# EAGLE design Payloadv04 (EAGLE 9.2.0)
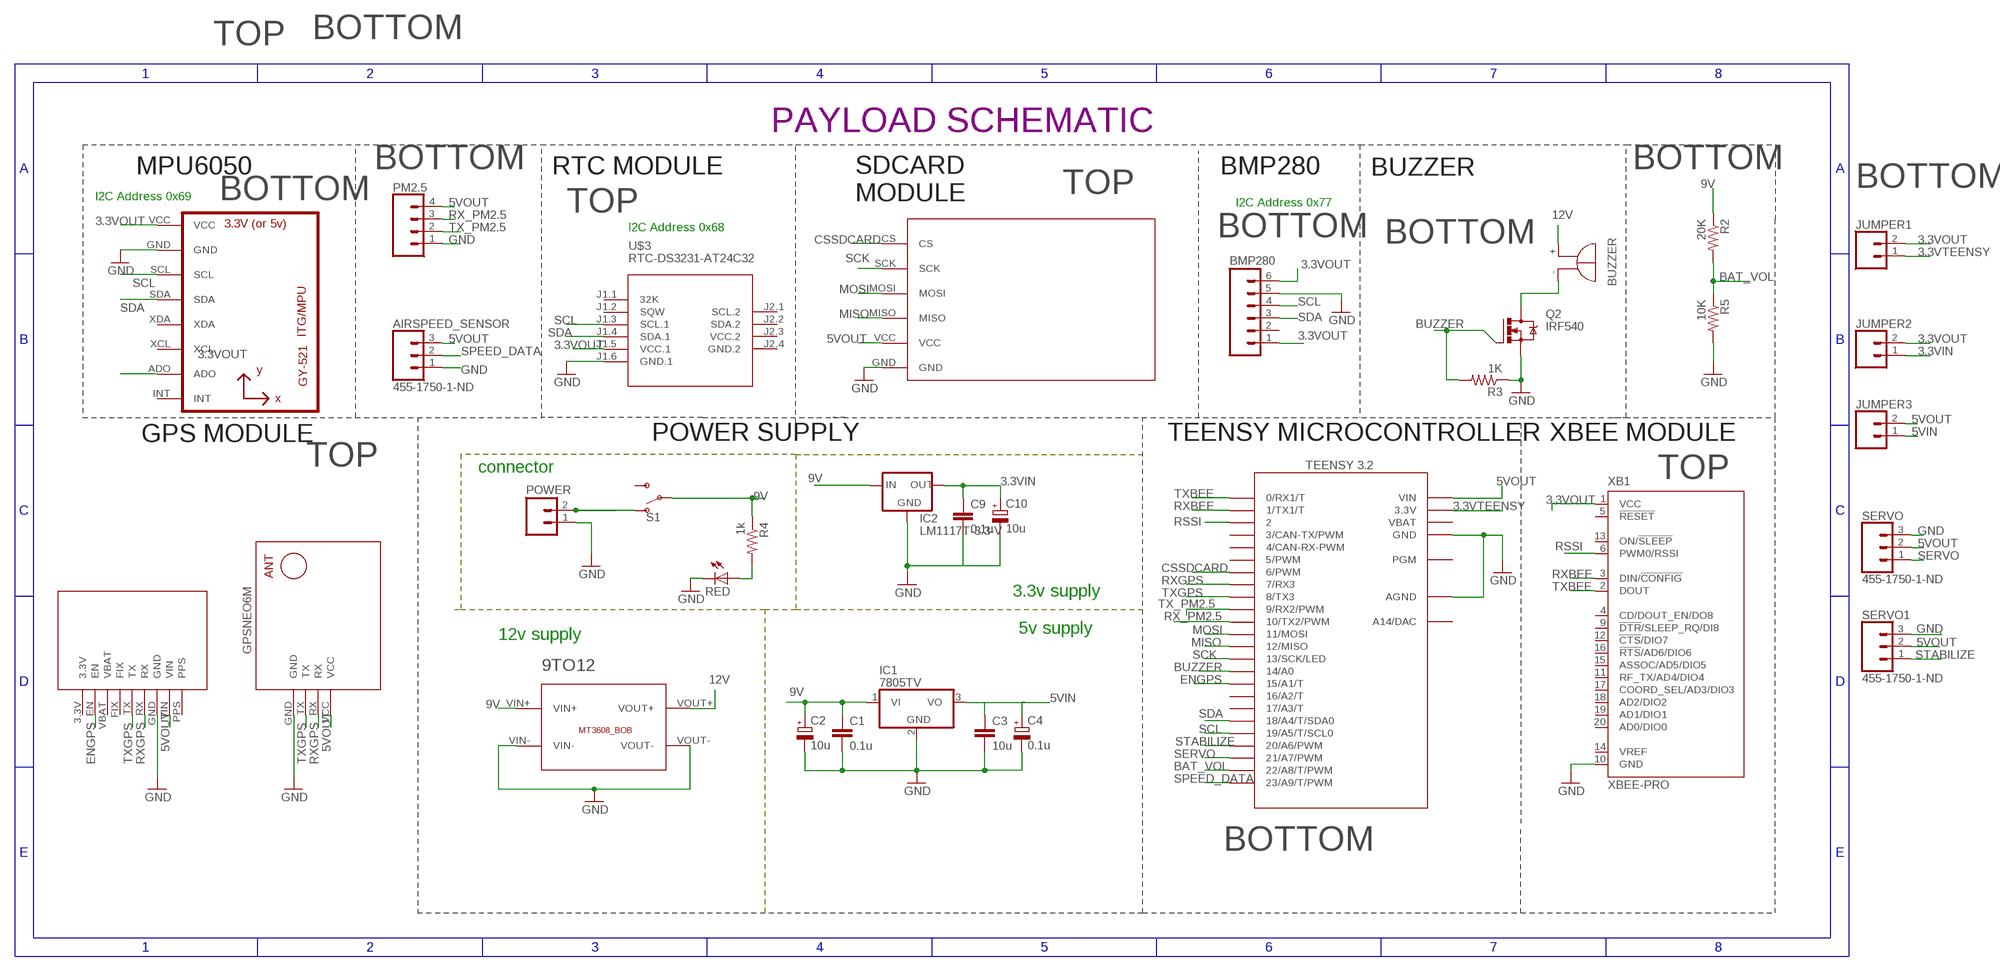
[diagram p0: schematic, sheet 1]

## Parts
9TO12  BREAKOUTS_MT3608_BOB  [BREAKOUTS_MT3608_BOB]
AIRSPEED_SENSOR  455-1750-1-ND  CONN_03  [1X03]
BMP280  M06  [06P]
C1  0.1u  C-EU025-025X050  [C025-025X050]
C2  10u  CPOL-EUE2.5-6  [E2,5-6]
C3  10u  C-EU025-025X050  [C025-025X050]
C4  0.1u  CPOL-EUE2.5-6  [E2,5-6]
C9  0.1u  C-EU025-025X050  [C025-025X050]
C10  10u  CPOL-EUE2.5-6  [E2,5-6]
IC1  7805TV  [TO220V]
IC2  LM1117T-3.3-V  [TO220V]
JUMPER1  CONN_02  [1X02]
JUMPER2  CONN_02  [1X02]
JUMPER3  CONN_02  [1X02]
PM2.5  CONN_04  [1X04]
POWER  CEDT_JANUARY_2015_V5_M02  [CEDT_JANUARY_2015_V5_02P]
Q2  IRF540  [TO220BV]
R2  20K  R-US_0204/7  [0204/7]
R3  1K  R-US_0204/7  [0204/7]
R4  1k  R-US_0204/7  [0204/7]
R5  10K  R-US_0204/7  [0204/7]
RED  red  LED3MM  [LED3MM]
S1  SWITCH-SPDT-PTH-11.6X4.0MM  [SWITCH_SPDT_PTH_11.6X4.0MM]
SERVO  455-1750-1-ND  CONN_03  [1X03]
SERVO1  455-1750-1-ND  CONN_03  [1X03]
SG1  BUZZER_EB2209A  [BUZZER_EB2209A]
U1  GY-521MPU6050  [GY-521]
U$1  GPS-RECEIVER-NEO6M  [GPS-RECEIVER-NEO6M]
U$2  TEENSY_3.1-3.2_OUTER_ROW  [TEENSY_3.0-3.2&LC_OUTER_ROW]
U$3  RTC-DS3231-AT24C32  [RTC-DS3231-AT24C32]
U$4  ADAFRUIT_GPS  [ADAFRUIT_GPS]
U$5  SDCARD  [M0SDCARDMODULE]
XB1  XBEE-PRO  [XBEE-PRO]

## Nets
3.3VIN: C9.1 C10.+ IC2.2(OUT) JUMPER2.1
3.3VOUT: BMP280.1 BMP280.6 JUMPER1.2 JUMPER2.2 U1.ADO U1.VCC U$3.J1.5(VCC.1) XB1.1(VCC)
3.3VTEENSY: JUMPER1.1 U$2.3.3V U$2.3.3V1(3.3V)
5VIN [power]: C3.1 C4.+ IC1.3(VO) JUMPER3.1
5VOUT: AIRSPEED_SENSOR.3 JUMPER3.2 PM2.5.4 SERVO1.2 SERVO.2 U$1.VCC U$2.VIN U$4.VIN U$5.VCC
9V [power]: 9TO12.VIN+ C1.1 C2.+ IC1.1(VI) IC2.3(IN) R2.1 R4.1 S1.2(P)
12V [power]: 9TO12.VOUT+ SG1.+
BAT_VOL: R2.2 R5.1 U$2.22/A8(22/A8/T/PWM)
BUZZER: Q2.G R3.2 U$2.14/A0
CSSDCARD: U$2.6(6/PWM) U$5.CS
ENGPS: U$2.15/A1(15/A1/T) U$4.EN
GND [power]: 9TO12.VIN- 9TO12.VOUT- AIRSPEED_SENSOR.1 BMP280.5 C1.2 C2.- C3.2 C4.- C9.2 C10.- IC1.2(GND) IC2.1(GND) PM2.5.1 POWER.1 Q2.S R3.1 R5.2 RED.K(C) SERVO1.3 SERVO.3 U1.GND U$1.GND U$2.AGND U$2.GND U$2.GND1(GND) U$3.J1.6(GND.1) U$4.GND U$5.GND XB1.10(GND)
MISO: U$2.12(12/MISO) U$5.MISO
MOSI: U$2.11(11/MOSI) U$5.MOSI
N$1 [power]: POWER.2 S1.1(O)
N$2: R4.2 RED.A
N$3 [power]: Q2.D SG1.-
RSSI: U$2.2 XB1.6(PWM0/RSSI)
RX_PM2.5: PM2.5.3 U$2.10(10/TX2/PWM)
RXBEE: U$2.1(1/TX1/T) XB1.3(DIN/!CONFIG)
RXGPS: U$1.RX U$2.7(7/RX3) U$4.RX
SCK: U$2.13(13/SCK/LED) U$5.SCK
SCL: BMP280.4 U1.SCL U$2.19/A5(19/A5/T/SCL0) U$3.J1.3(SCL.1)
SDA: BMP280.3 U1.SDA U$2.18/A4(18/A4/T/SDA0) U$3.J1.4(SDA.1)
SERVO: SERVO.1 U$2.21/A7(21/A7/PWM)
SPEED_DATA: AIRSPEED_SENSOR.2 U$2.23/A9(23/A9/T/PWM)
STABILIZE: SERVO1.1 U$2.20/A6(20/A6/PWM)
TX_PM2.5: PM2.5.2 U$2.9(9/RX2/PWM)
TXBEE: U$2.0(0/RX1/T) XB1.2(DOUT)
TXGPS: U$1.TX U$2.8(8/TX3) U$4.TX
Unconnected: BMP280.2 S1.3(S) U1.INT U1.XCL U1.XDA U$2.3(3/CAN-TX/PWM) U$2.4(4/CAN-RX-PWM) U$2.5(5/PWM) U$2.16/A2(16/A2/T) U$2.17/A3(17/A3/T) U$2.PGM U$2.RESET/DAC(A14/DAC) U$3.J1.1(32K) U$3.J1.2(SQW) U$3.J2.1(SCL.2) U$3.J2.2(SDA.2) U$4.3.3V U$4.FIX U$4.PPS U$4.VBAT XB1.4(CD/DOUT_EN/DO8) XB1.5(!RESET) XB1.9(!DTR!/SLEEP_RQ/DI8) XB1.11(RF_TX/AD4/DIO4) XB1.12(!CTS!/DIO7) XB1.13(ON/!SLEEP) XB1.14(VREF) XB1.15(ASSOC/AD5/DIO5) XB1.16(!RTS!/AD6/DIO6) XB1.17(COORD_SEL/AD3/DIO3) XB1.18(AD2/DIO2) XB1.19(AD1/DIO1) XB1.20(AD0/DIO0)

## Notes on the sheet
- TOP | BOTTOM
- PAYLOAD SCHEMATIC
- MPU6050 | BOTTOM | RTC MODULE | BMP280 | BUZZER | BOTTOM
- TOP | BOTTOM
- I2C Address 0x69 | BOTTOM
- SDCARD
  MODULE
- I2C Address 0x77
- TOP
- I2C Address 0x68
- BOTTOM | BOTTOM
- GPS MODULE | POWER SUPPLY | TEENSY MICROCONTROLLER | XBEE MODULE
- TOP
- connector
- TOP
- 3.3v supply
- 5v supply
- 12v supply
- BOTTOM

## Power pins joined to a net without a drawn wire
GND.2: U$3.J2.4(GND.2)
VBAT: U$2.VBAT
VCC.2: U$3.J2.3(VCC.2)

## Library data of the parts
9TO12 = Cansat2019_3279_Container_v01:BREAKOUTS_MT3608_BOB
AIRSPEED_SENSOR SERVO SERVO1 = SparkFun-Connectors:CONN_03: Multi connection point. Often used as Generic Header-pin footprint for 0.1 inch spaced/style header connections On any of the 0.1 inch spaced packages, you can populate with these: Break Away Headers - Straight <https://www.sparkfun.com/products/116> (PRT-00116) Break Away Male Headers - Right Angle <https://www.sparkfun.com/products/553> (PRT-00553) Female Headers <https://www.sparkfun.com/products/115> (PRT-00115) Break Away Headers - Machine Pin <https://www.sparkfun.com/products/117> (PRT-00117) Break Away Female Headers - Swiss Machine Pin <https://www.sparkfun.com/products/743> (PRT-00743) Stackable Header - 3 Pin (Female, 0.1") <https://www.sparkfun.com/products/13875> (PRT-13875) For SCREWTERMINALS and SPRING TERMINALS visit here: Screw Terimnals on SparkFun.com <https://www.sparkfun.com/search/results?term=Screw+Terminals> (5mm/3.5mm/2.54mm spacing) This device is also useful as a general connection point to wire up your design to another part of your project. Our various solder wires solder well into these plated through hole pads. Hook-Up Wire - Assortment (Stranded, 22 AWG) <https://www.sparkfun.com/products/11375> (PRT-11375) Hook-Up Wire - Assortment (Solid Core, 22 AWG) <https://www.sparkfun.com/products/11367> (PRT-11367) View the entire wire category on our website here <https://www.sparkfun.com/categories/141> Special notes: Molex polarized connector foot print use with SKU : PRT-08232 with associated crimp pins and housings.; PROD_ID: XXX-00000
BMP280 = con-amp-quick:M06: AMP QUICK CONNECTOR; OC_FARNELL: unknown; OC_NEWARK: unknown
C1 C3 C9 = resistor:C-EU: CAPACITOR, European symbol
C2 C4 C10 = rcl:CPOL-EU: POLARIZED CAPACITOR, European symbol; SPICEPREFIX: C
IC1 = linear:78*: Positive VOLTAGE REGULATOR Source: http://cache.national.com/ds/LM/LM78L05.pdf http://www.fairchildsemi.com/ds/LM/LM7805.pdf
IC2 = lm1117:LM1117T-*
JUMPER1-JUMPER3 = SparkFun-Connectors:CONN_02: Multi connection point. Often used as Generic Header-pin footprint for 0.1 inch spaced/style header connections On any of the 0.1 inch spaced packages, you can populate with these: Break Away Headers - Straight <https://www.sparkfun.com/products/116> (PRT-00116) Break Away Male Headers - Right Angle <https://www.sparkfun.com/products/553> (PRT-00553) Female Headers <https://www.sparkfun.com/products/115> (PRT-00115) Break Away Headers - Machine Pin <https://www.sparkfun.com/products/117> (PRT-00117) Break Away Female Headers - Swiss Machine Pin <https://www.sparkfun.com/products/743> (PRT-00743) For SCREWTERMINALS and SPRING TERMINALS visit here: Screw Terimnals on SparkFun.com <https://www.sparkfun.com/search/results?term=Screw+Terminals> (5mm/3.5mm/2.54mm spacing) This device is also useful as a general connection point to wire up your design to another part of your project. Our various solder wires solder well into these plated through hole pads. Hook-Up Wire - Assortment (Stranded, 22 AWG) <https://www.sparkfun.com/products/11375> (PRT-11375) Hook-Up Wire - Assortment (Solid Core, 22 AWG) <https://www.sparkfun.com/products/11367> (PRT-11367) View the entire wire category on our website here <https://www.sparkfun.com/categories/141> Special notes: Molex polarized connector foot print use with: PRT-08233 with associated crimp pins and housings. 2.54_SCREWTERM for use with PRT-10571. 3.5mm Screw Terminal footprints for PRT-08084 5mm Screw Terminal footprints for use with PRT-08432
PM2.5 = SparkFun-Connectors:CONN_04: Multi connection point. Often used as Generic Header-pin footprint for 0.1 inch spaced/style header connections On any of the 0.1 inch spaced packages, you can populate with these: Break Away Headers - Straight <https://www.sparkfun.com/products/116> (PRT-00116) Break Away Male Headers - Right Angle <https://www.sparkfun.com/products/553> (PRT-00553) Female Headers <https://www.sparkfun.com/products/115> (PRT-00115) Break Away Headers - Machine Pin <https://www.sparkfun.com/products/117> (PRT-00117) Break Away Female Headers - Swiss Machine Pin <https://www.sparkfun.com/products/743> (PRT-00743) For SCREWTERMINALS and SPRING TERMINALS visit here: Screw Terimnals on SparkFun.com <https://www.sparkfun.com/search/results?term=Screw+Terminals> (5mm/3.5mm/2.54mm spacing) This device is also useful as a general connection point to wire up your design to another part of your project. Our various solder wires solder well into these plated through hole pads. Hook-Up Wire - Assortment (Stranded, 22 AWG) <https://www.sparkfun.com/products/11375> (PRT-11375) Hook-Up Wire - Assortment (Solid Core, 22 AWG) <https://www.sparkfun.com/products/11367> (PRT-11367) View the entire wire category on our website here <https://www.sparkfun.com/categories/141> Special notes: Molex polarized connector foot print use with SKU : PRT-08231 with associated crimp pins and housings. 1MM SMD Version SKU: PRT-10208; PROD_ID: CONN-09696
POWER = Cansat2019_3279_Container_v01:CEDT_JANUARY_2015_V5_M02: AMP QUICK CONNECTOR
Q2 = transistor-power:IRF540: HEXFET Power MOSFET
R2-R5 = rcl:R-US_: RESISTOR, American symbol; SPICEPREFIX: R
RED = CEDT_JANUARY_2015_v5:LED
S1 = SparkFun-Switches:SWITCH-SPDT: Single Pole, Double Throw (SPDT) Switch Single-pole, double-throw (SPDT) switch. Variant Overview SMD-AYZ0202 Surface Mount DPDT Switch <https://www.sparkfun.com/products/597> (COM-00597) Used on e.g. LilyPad Arduino USB - ATmega32U4 Board <https://www.sparkfun.com/products/12049> PTH-11.6X4.0MM SPDT Mini Power Switch <https://www.sparkfun.com/products/102> (COM-00102) Used on e.g. SparkFun Simon Says - Through-Hole Soldering Kit <https://www.sparkfun.com/products/10547> (KIT-10547) PTH-11.6X4.0MM-KIT KIT version of SPDT Mini Power Switch - Simplifies soldering by removing tStop of switch pins - only one side can be soldered. PTH-11.6X4.0MM-LOCK LOCK version of SPDT Mini Power Switch - Offset pins hold switch in place for easier soldering. SMD-RIGHT-ANGLE Surface Mount Right Angle Switch <https://www.sparkfun.com/products/10860> (COM-10860) Used on e.g. SparkFun ESP8266 Thing <https://www.sparkfun.com/products/13231>; PROD_ID: SWCH-08261; SF_SKU: COM-00102
SG1 = Cansat2019_3279_Container_v01:BUZZER_EB2209A: BUZZER Source: Buerklin; OC_FARNELL: unknown; OC_NEWARK: unknown
U1 = gy-521:GY-521
U$1 = diy-modules:GPS-RECEIVER-NEO6M: GPS Receiver Module based on NEO-6 device Short tutorial how to use NEO-6 module with Arduino: http://www.xarg.org/2016/06/neo6mv2-gps-module-with-arduino/ NEO-6 datasheet is available here: https://www.u-blox.com/sites/default/files/products/documents/NEO-6_DataSheet_%28GPS.G6-HW-09005%29.pdf Click here to find device on ebay.com <http://www.ebay.com/sch/gyneo6mv2>
U$2 = Teensy_3_and_LC_Series_Boards_v1.4:TEENSY_3.1-3.2_OUTER_ROW: Footprint for Teensy 3.1 or 3.2 board using all pin connections on the outer perimeter
U$3 = diy-modules:RTC-DS3231-AT24C32: RTC Module with Battery and EEPROM based on DS3231 and AT24C32 chips Tutorial can be found here: https://edwardmallon.wordpress.com/2014/05/21/using-a-cheap-3-ds3231-rtc-at24c32-eeprom-from-ebay/ Click here to find device on ebay.com <http://www.ebay.com/sch/DS3231+AT24C32+module>
U$4 = myLib_adafruit_gps:ADAFRUIT_GPS
U$5 = mylib:SDCARD
XB1 = maxstream:XBEE: XBee (TM) /XBee-PRO(TM) OEM RF Modules Source: MaxStream, Inc. xbee_productmanual.pdf; MPN: XBP24-AWI-001; OC_FARNELL: 1337916; OC_NEWARK: 42M2667

## Net classes
0 default: width 0.508 mm
1 power: width 0.61 mm

## Board
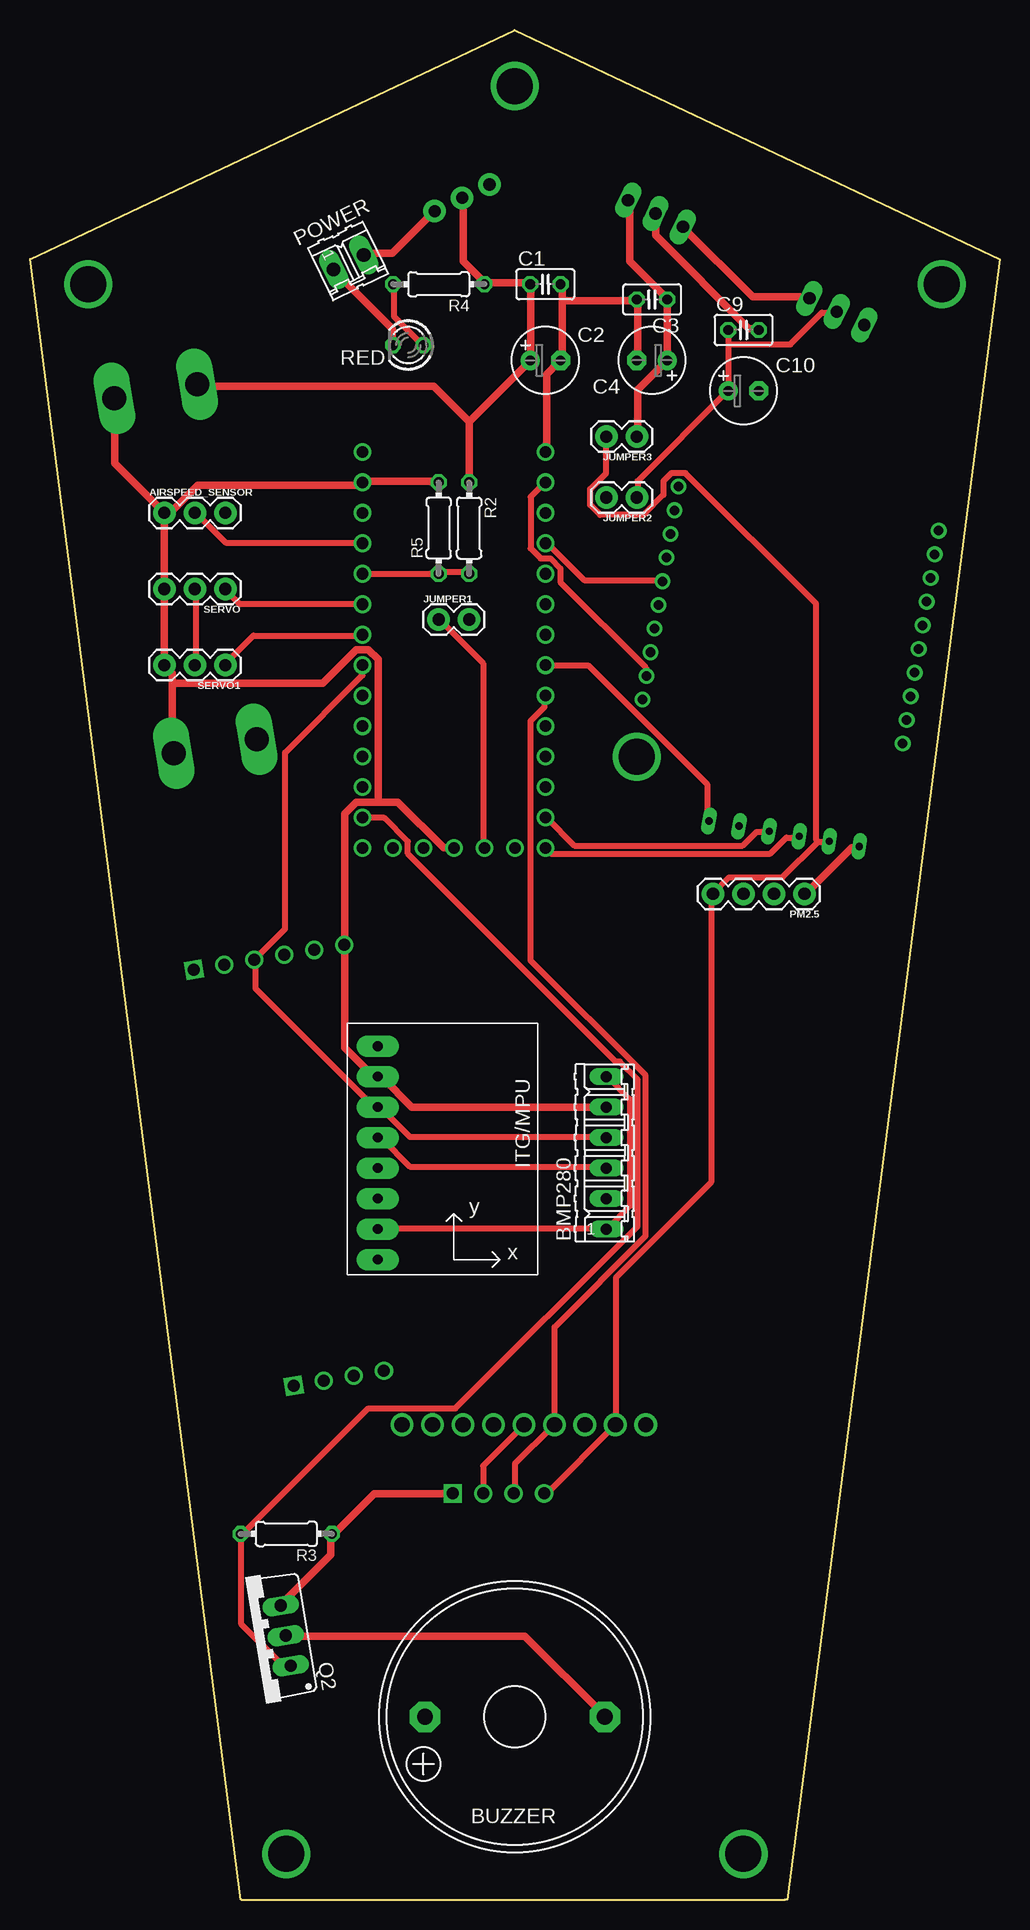
[diagram p1: board, top side]
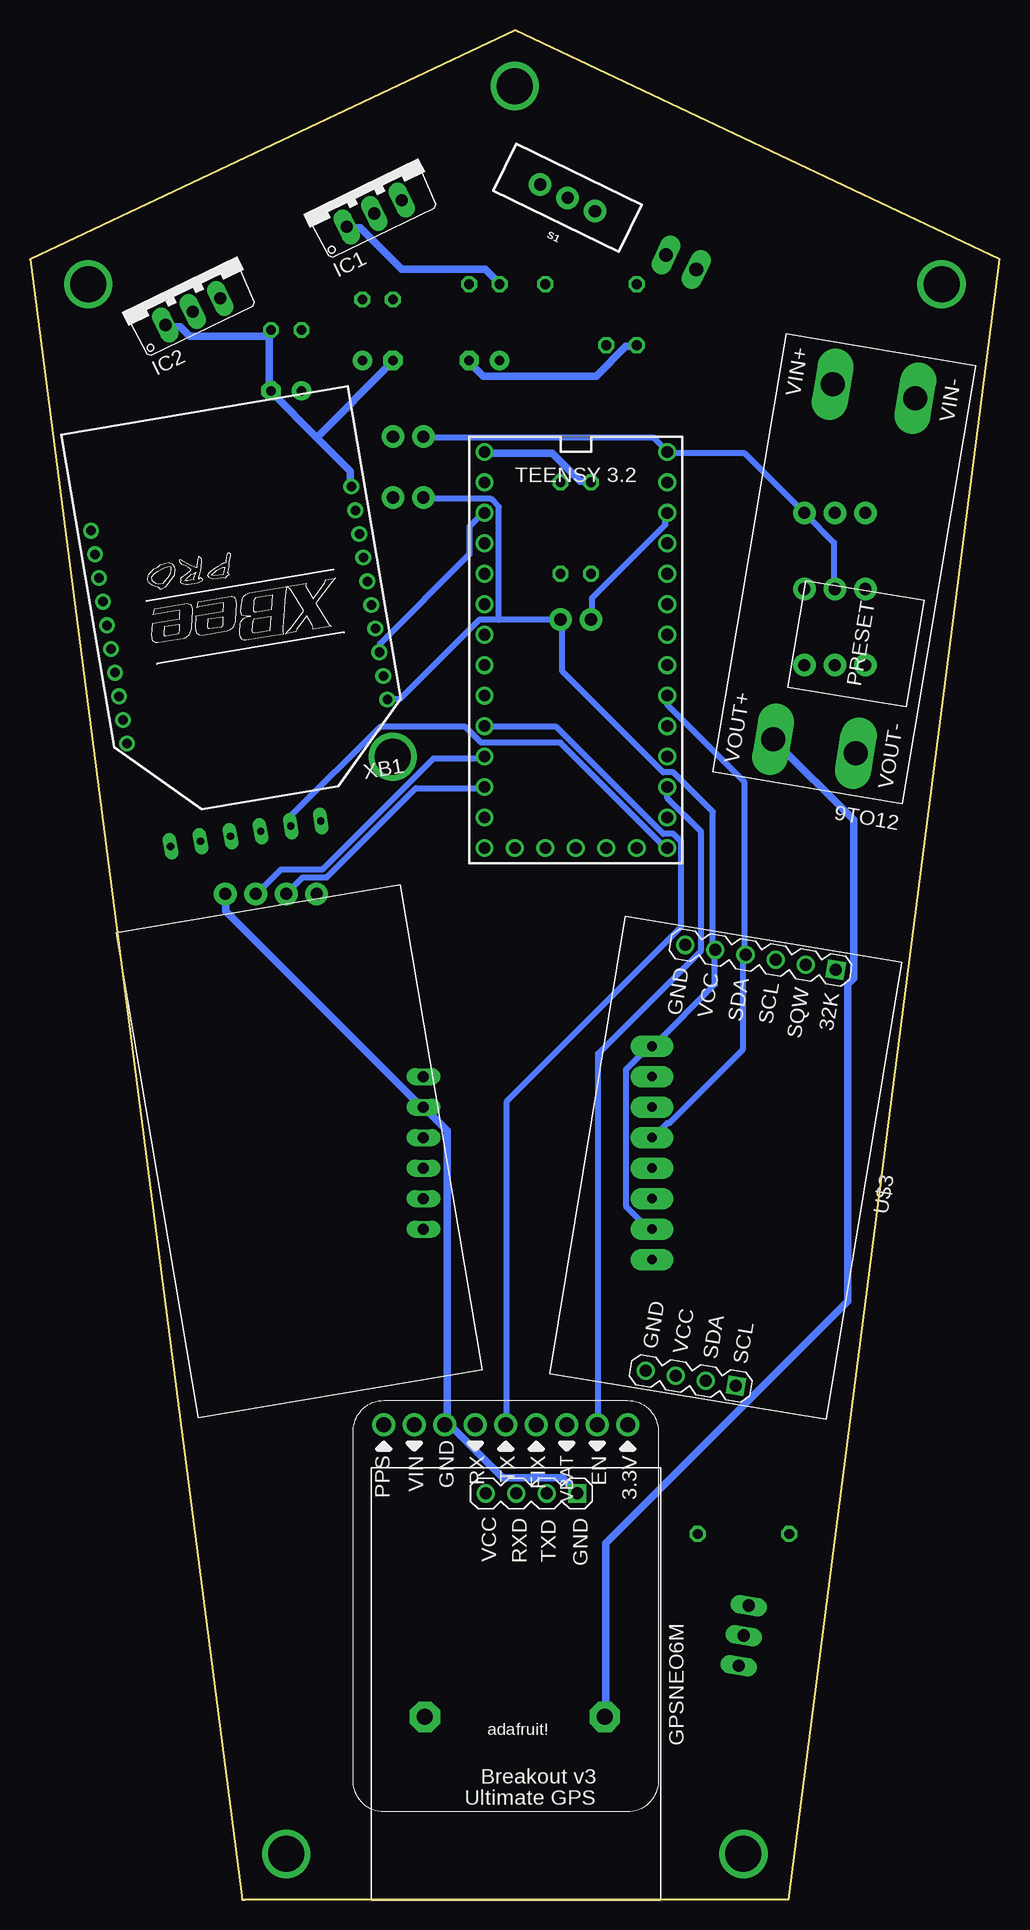
[diagram p2: board, bottom side, seen from below]

Size 80.81 x 155.81 mm. Coordinates in mm from the lower left corner, seen from the top.
Outline: 17.62,0.01 62.92,0.01
Outline: 17.58,0 0,136.7 40.38,155.81 80.81,136.7 63.12,0
Outline: 63.12,0 62.88,0
Copper layers (1*16): Top 0.035mm / dielectric 1.5mm / Bottom 0.035mm
Design rules "default": minimum track width 6mil, minimum drill 0.35mm, track to track 6mil, track to pad 6mil, pad to pad 6mil, via to via 6mil, smd to smd 6mil, copper to edge 40mil, drill to drill 6mil, minimum pad ring 10mil, minimum via ring 8mil, stop-mask expansion 4mil, vias tented up to drill 0mil, thermal gap 10mil

### Footprints (pad centres in the part's own frame; a part is rotated, then mirrored left to right if it is on the bottom)
BREAKOUTS_MT3608_BOB = drill 2 pad 3 long: VIN+ 33.5,-4.5; VIN- 33.5,-11.5; VOUT+ 3.5,-4.5; VOUT- 3.5,-11.5
1X03 = drill 1.016 pad 1.88: 1 0,0; 2 2.54,0; 3 5.08,0
06P = drill 0.914 long: 1 -6.35,0; 2 -3.81,0; 3 -1.27,0; 4 1.27,0; 5 3.81,0; 6 6.35,0
C025-025X050 = drill 0.813 octagon: 1 -1.27,0; 2 1.27,0
E2,5-6 = drill 0.813 pad 1.6: + -1.27,0 | drill 0.813 pad 1.6 octagon: - 1.27,0
TO220V = drill 1.016 long: 1 -2.54,-2.54; 2 0,-2.54; 3 2.54,-2.54
1X02 = drill 1.016 pad 1.88: 1 0,0; 2 2.54,0
1X04 = drill 1.016 pad 1.88: 1 0,0; 2 2.54,0; 3 5.08,0; 4 7.62,0
CEDT_JANUARY_2015_V5_02P = drill 1.143 long: 1 -1.397,0; 2 1.397,0
TO220BV = drill 1.016 long: D 0,-2.54; G -2.54,-2.54; S 2.54,-2.54
0204/7 = drill 0.813 octagon: 1 -3.81,0; 2 3.81,0
LED3MM = drill 0.813 octagon: A -1.27,0; K 1.27,0
SWITCH_SPDT_PTH_11.6X4.0MM = drill 1.016 pad 1.88: 1 0,2.54; 2 0,0; 3 0,-2.54
BUZZER_EB2209A = drill 1.321 pad 2.54 octagon: + 7.493,0; - -7.493,0
GY-521 = drill 0.8 pad 1.778 long: ADO -8.89,-6.35; GND -8.89,6.35; INT -8.89,-8.89; SCL -8.89,3.81; SDA -8.89,1.27; VCC -8.89,8.89; XCL -8.89,-3.81; XDA -8.89,-1.27
GPS-RECEIVER-NEO6M = drill 1 square: GND -15.875,5.08 | drill 1: RX -15.875,0; TX -15.875,2.54; VCC -15.875,-2.54
TEENSY_3.0-3.2&LC_OUTER_ROW = drill 0.965: 0 -7.62,13.97; 1 -7.62,11.43; 2 -7.62,8.89; 3 -7.62,6.35; 3.3V 7.62,11.43; 3.3V1 -2.54,-16.51; 4 -7.62,3.81; 5 -7.62,1.27; 6 -7.62,-1.27; 7 -7.62,-3.81; 8 -7.62,-6.35; 9 -7.62,-8.89; 10 -7.62,-11.43; 11 -7.62,-13.97; 12 -7.62,-16.51; 13 7.62,-16.51; 14/A0 7.62,-13.97; 15/A1 7.62,-11.43; 16/A2 7.62,-8.89; 17/A3 7.62,-6.35; 18/A4 7.62,-3.81; 19/A5 7.62,-1.27; 20/A6 7.62,1.27; 21/A7 7.62,3.81; 22/A8 7.62,6.35; 23/A9 7.62,8.89; AGND 7.62,13.97; GND -7.62,16.51; GND1 0,-16.51; PGM 2.54,-16.51; RESET/DAC 5.08,-16.51; VBAT -5.08,-16.51; VIN 7.62,16.51
RTC-DS3231-AT24C32 = drill 1 square: J1.1 -17.78,6.35; J2.1 17.78,3.81 | drill 1: J1.2 -17.78,3.81; J1.3 -17.78,1.27; J1.4 -17.78,-1.27; J1.5 -17.78,-3.81; J1.6 -17.78,-6.35; J2.2 17.78,1.27; J2.3 17.78,-1.27; J2.4 17.78,-3.81
ADAFRUIT_GPS = drill 1.27: 3.3V 2.54,2.032; EN 5.08,2.032; FIX 10.16,2.032; GND 17.78,2.032; PPS 22.86,2.032; RX 15.24,2.032; TX 12.7,2.032; VBAT 7.62,2.032; VIN 20.32,2.032
M0SDCARDMODULE = drill 0.6 long: CS -6.35,6.35; GND -6.35,-6.35; MISO -6.35,-1.27; MOSI -6.35,1.27; SCK -6.35,3.81; VCC -6.35,-3.81
XBEE-PRO = drill 0.8 pad 1.27: 1 -11,9; 2 -11,7; 3 -11,5; 4 -11,3; 5 -11,1; 6 -11,-1; 7 -11,-3; 8 -11,-5; 9 -11,-7; 10 -11,-9; 11 11,-9; 12 11,-7; 13 11,-5; 14 11,-3; 15 11,-1; 16 11,1; 17 11,3; 18 11,5; 19 11,7; 20 11,9

### Placement (x,y rotation side)
9TO12  23.9,93.98 80.5 bottom
AIRSPEED_SENSOR  11.2,115.57 0 top
BMP280  48.03,62.23 90 top
C1  42.95,134.62 0 top
C2  42.95,128.27 0 top
C3  51.84,133.35 180 top
C4  51.84,128.27 180 top
C9  59.46,130.81 0 top
C10  59.46,125.73 0 top
IC1  53.23,142.8 25.9 bottom
IC2  68.35,134.62 25.9 bottom
JUMPER1  34.06,106.68 0 top
JUMPER2  50.57,116.84 180 top
JUMPER3  50.57,121.92 180 top
PM2.5  64.54,83.82 180 top
POWER  26.55,136.45 25.9 top
Q2  18.82,21.59 99.4 top
R2  36.6,114.3 270 top
R3  21.36,30.48 180 top
R4  34.06,134.62 180 top
R5  34.06,114.3 90 top
RED  31.52,129.54 180 top
S1  36.01,141.81 244.1 bottom
SERVO  16.28,109.22 180 top
SERVO1  16.28,102.87 180 top
SG1  40.41,15.24 180 top
U1  37.87,62.23 0 top
U$1  40.29,17.98 270 bottom
U$2  35.33,104.14 0 bottom
U$3  22.83,60.98 260.6 bottom
U$4  28.46,41.6 180 bottom
U$5  61.79,82.57 279.6 bottom
XB1  63.38,107.04 189.6 bottom

### Tracks (layer width: path | path; a pad name or v marks a point on that pad's centre or on a via)
3.3VIN
  Top 0.508: 58.24,129.6 58.24,125.81 C10.+ 58.07,125.64 50.64,118.21 50.64,116.89 JUMPER2.1 | 58.24,129.6 58.24,130.76 C9.1 | 58.24,129.6 63.36,129.6 66,132.25 67.15,132.25 IC2.2
3.3VOUT
  Top 0.508: BMP280.6 48.17,68.52 49.98,66.7 49.98,57.79 48.17,55.97 BMP280.1 47.84,55.97 29.01,55.97 U1.ADO
  Bottom 0.508: 41.73,106.66 36.61,106.66 JUMPER1.2 36.44,106.49 36.44,102.36 28.02,93.94 27.2,93.94 23.9,90.64 23.9,79.25 U$3.J1.5 23.73,79.08 23.73,76.28 28.85,71.16 U1.VCC 29.18,71.16 31.16,69.18 31.16,57.79 29.34,55.97 29.01,55.97 U1.ADO | 41.73,106.66 43.38,106.66 49.98,100.05 50.97,100.05 XB1.1 | 41.73,106.66 41.73,116.07 42.39,116.73 48,116.73 JUMPER2.2
3.3VTEENSY
  Top 0.508: U$2.3.3V1 37.76,87.67 37.76,103.02 34.13,106.66 JUMPER1.1
  Bottom 0.508: U$2.3.3V 27.86,115.57 27.86,114.58 33.97,108.47 33.97,106.82 JUMPER1.1
5VIN
  Top 0.61: IC1.3 49.98,141.49 49.98,136.54 52.95,133.57 C3.1 53.12,133.24 53.12,128.28 C4.+ 50.64,125.81 50.64,122.01 JUMPER3.1
5VOUT
  Top 0.508: SERVO1.2 13.83,103.02 13.83,109.13 SERVO.2 | U$1.VCC 42.88,34.01 43.21,34.01 48.66,39.46 U$4.VIN 48.83,39.79 48.83,51.84 56.75,59.77 56.75,83.71 PM2.5.4 56.92,83.87 58.24,85.19 62.69,85.19 65.67,88.16 | 65.67,88.16 66.49,88.16 U$5.VCC | JUMPER3.2 48,121.84 48,118.87 46.68,117.55 46.68,116.23 47.51,115.41 51.14,115.41 52.79,117.06 52.79,118.21 53.45,118.87 54.61,118.87 65.5,107.98 65.5,88.33 65.67,88.16
  Bottom 0.508: JUMPER3.2 48,121.84 28.85,121.84 27.86,120.85 U$2.VIN 27.69,120.52 21.25,120.52 16.3,115.57 AIRSPEED_SENSOR.3 16.14,115.41 13.83,113.09 13.83,109.3 SERVO.2
9V
  Top 0.61: IC2.3 64.84,133.57 60.22,133.57 54.44,139.34 IC1.1 | S1.2 36.11,141.66 36.11,136.54 37.76,134.89 R4.1 37.93,134.72 41.56,134.72 C1.1 41.73,134.39 41.73,128.45 C2.+ 41.56,128.12 36.61,123.17 | 36.61,123.17 36.61,118.21 R2.1 | 36.61,123.17 33.64,126.14 13.99,126.14 9TO12.VIN+
  Bottom 0.61: IC1.1 54.27,139.34 53.28,139.34 49.82,135.88 42.88,135.88 41.73,134.72 C1.1
12V
  Bottom 0.61: SG1.+ 32.81,15.35 32.81,29.72 12.67,49.86 12.67,76.28 12.17,76.77 12.17,89.98 18.78,96.59 9TO12.VOUT+
BAT_VOL
  Top 0.508: R2.2 36.44,110.62 34.13,110.62 R5.1 33.97,110.45 27.86,110.45 U$2.22/A8
BUZZER
  Top 0.508: Q2.G 21.59,19.65 20.92,19.65 17.62,22.95 17.62,30.38 R3.2 17.79,30.55 28.19,40.95 35.45,40.95 50.64,56.13 50.64,68.35 49.16,69.84 48.83,69.84 31.49,87.17 31.49,88.16 29.51,90.15 27.86,90.15 U$2.14/A0
CSSDCARD
  Top 0.508: U$5.CS 56.42,89.98 56.42,92.95 46.52,102.86 43.05,102.86 U$2.6
ENGPS
  Bottom 0.508: U$2.15/A1 27.69,92.62 27.69,91.8 24.89,88.99 24.89,79.08 33.47,70.5 33.47,39.62 U$4.EN
GND
  Top 0.61: AIRSPEED_SENSOR.1 11.18,115.57 11.18,109.46 SERVO.3 11.18,109.13 11.18,103.02 SERVO1.3 11.35,102.69 11.84,102.2 11.84,101.37 | 11.84,101.37 11.84,95.59 9TO12.VOUT- | 9TO12.VIN- 7.06,124.98 7.06,119.7 11.02,115.74 AIRSPEED_SENSOR.1 | IC1.2 52.13,138.69 59.89,130.93 60.71,130.93 C9.2 | RED.K 30.17,129.6 30.17,130.93 25.38,135.71 POWER.1 | R5.2 33.97,118.21 27.86,118.21 U$2.AGND 27.53,117.88 13.99,117.88 11.84,115.74 11.35,115.74 AIRSPEED_SENSOR.1 | C4.- 50.64,128.28 50.64,133.24 C3.2 50.31,133.24 44.37,133.24 | 44.37,133.24 44.37,128.28 C2.- 44.04,128.12 43.05,127.13 43.05,120.69 U$2.GND | 44.37,133.24 44.37,134.56 C1.2 | Q2.S 20.92,24.6 25.05,28.73 25.05,30.38 R3.1 25.38,30.55 28.68,33.85 35.12,33.85 U$1.GND | 29.01,91.47 27.2,91.47 26.21,90.48 26.21,79.58 U$3.J1.6 26.21,79.25 26.21,70.99 28.68,68.52 U1.GND 29.01,68.52 29.34,68.52 31.82,66.04 BMP280.5 | 29.01,91.47 30.67,91.47 34.46,87.67 35.29,87.67 U$2.GND1 | U$5.GND 68.97,87.67 68.47,87.67 64.68,83.87 PM2.5.1 | 11.84,101.37 24.39,101.37 27.2,104.18 28.19,104.18 29.01,103.35 29.01,91.47
  Bottom 0.61: 56.92,121.84 60.71,125.64 C10.- 60.88,125.97 60.88,130.76 C9.2 61.04,130.27 67.48,130.27 68.31,131.09 69.47,131.09 IC2.1 | 56.92,121.84 54.11,119.04 54.11,117.88 XB1.10 | R5.2 34.13,118.21 34.96,118.21 37.27,120.52 42.88,120.52 U$2.GND | RED.K 30.34,129.44 31.16,129.44 33.64,126.96 43.05,126.96 44.2,128.12 C2.- | 56.92,121.84 50.64,128.12 C4.- | U$1.GND 35.29,34.01 36.44,35.17 41.4,35.17 45.69,39.46 46.19,39.46 U$4.GND 46.02,39.79 46.02,64.06 47.84,65.88 BMP280.5 48.17,66.04 64.51,82.39 64.51,83.71 PM2.5.1
MISO
  Top 0.508: U$5.MISO 64.02,88.5 63.03,88.5 61.7,87.17 43.38,87.17 43.05,87.5 U$2.12
MOSI
  Top 0.508: U$5.MOSI 61.54,88.99 60.55,88.99 59.39,87.83 45.36,87.83 43.05,90.15 U$2.11
N$1
  Top 0.61: POWER.2 27.86,137.2 30.17,137.2 33.64,140.67 S1.1
N$2
  Top 0.508: R4.2 30.34,134.56 30.34,131.92 32.65,129.6 RED.A
N$3
  Top 0.61: Q2.D 21.42,21.96 41.23,21.96 47.84,15.35 SG1.-
N$4  (via drill 3)
  other vias: 40.41,151.13
N$5  (via drill 3)
  other vias: 50.57,95.25
N$6  (via drill 3)
  other vias: 75.97,134.62
N$7  (via drill 3)
  other vias: 21.36,3.81
N$8  (via drill 3)
  other vias: 59.46,3.81
N$9  (via drill 3)
  other vias: 4.85,134.62
RSSI
  Top 0.508: XB1.6 52.62,109.96 46.19,109.96 43.05,113.09 U$2.2
RX_PM2.5
  Bottom 0.508: U$2.10 43.05,92.62 48.66,92.62 56.09,85.19 58.07,85.19 59.39,83.87 PM2.5.3
RXBEE
  Bottom 0.508: XB1.3 51.63,104.01 51.63,104.67 44.2,112.1 44.2,114.42 43.05,115.57 U$2.1
RXGPS
  Top 0.508: U$2.7 42.88,100.22 42.88,99.39 41.73,98.23 41.73,78.26 51.3,68.68 51.3,55.31 43.71,47.71 43.71,39.62 U$4.RX 43.54,39.46 40.41,36.32 40.41,34.01 U$1.RX
SCK
  Bottom 0.508: U$5.SCK 59.06,89.48 59.06,90.31 51.63,97.74 44.53,97.74 43.21,96.42 36.61,96.42 27.86,87.67 U$2.13
SCL
  Top 0.508: BMP280.4 48,63.56 31.66,63.56 29.18,66.04 U1.SCL 28.85,66.21 28.52,66.21 18.78,75.95 18.78,78.09 U$3.J1.3 18.78,78.42 21.25,80.9 21.25,95.59 27.69,102.03 27.69,102.86 U$2.19/A5
SDA
  Top 0.508: BMP280.3 48,61.09 31.66,61.09 29.34,63.4 29.01,63.4 U1.SDA
  Bottom 0.508: U$2.18/A4 27.69,100.22 27.69,99.56 21.25,93.12 21.25,78.75 U$3.J1.4 21.42,78.59 21.42,70.83 27.53,64.72 27.69,64.72 28.85,63.56 U1.SDA
SERVO
  Top 0.508: U$2.21/A7 27.69,107.98 17.46,107.98 16.3,109.13 SERVO.1
SPEED_DATA
  Top 0.508: U$2.23/A9 27.69,113.09 16.3,113.09 13.83,115.57 AIRSPEED_SENSOR.2
STABILIZE
  Top 0.508: U$2.20/A6 27.69,105.34 18.61,105.34 16.3,103.02 SERVO1.1
TX_PM2.5
  Bottom 0.508: U$2.9 43.05,95.1 47.18,95.1 56.42,85.85 59.89,85.85 61.87,83.87 PM2.5.2
TXBEE
  Top 0.508: U$2.0 41.73,116.89 41.73,112.6 42.55,111.77 43.38,111.77 44.2,110.95 44.2,109.79 51.3,102.69 51.3,102.03 XB1.2
TXGPS
  Top 0.508: U$1.TX 37.76,34.01 37.76,36.16 41.07,39.46 U$4.TX
  Bottom 0.508: U$2.8 42.88,97.74 36.94,97.74 28.02,88.83 27.2,88.83 26.54,88.16 26.54,81.06 41.07,66.54 41.07,39.62 U$4.TX